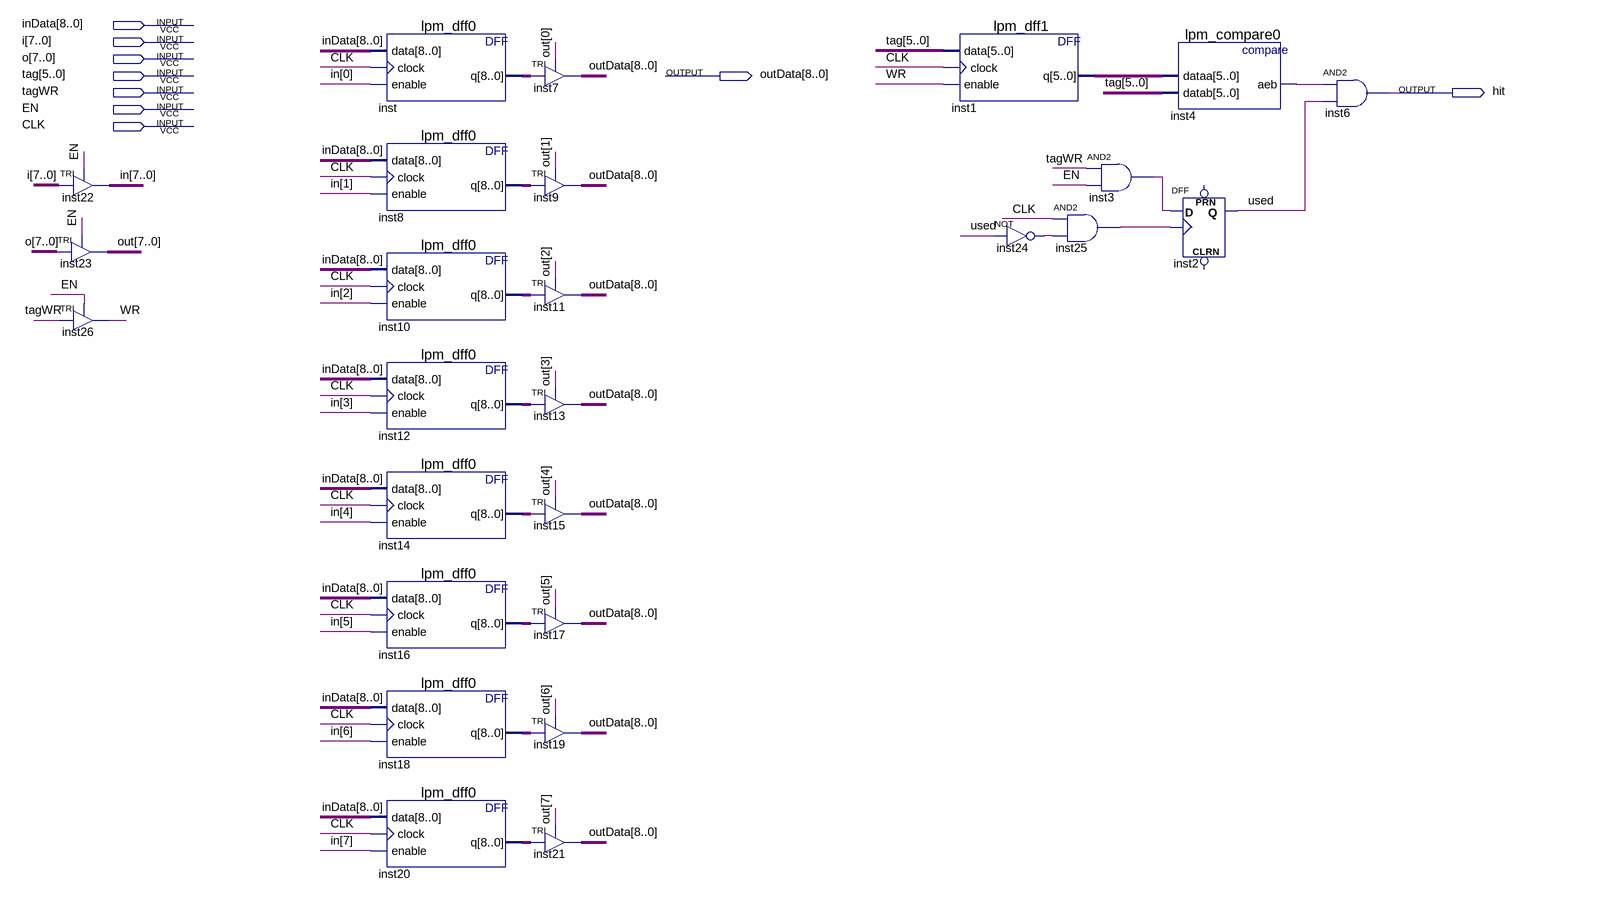
[diagram p0: schematic sheet]
// Quartus schematic line.bdf as structural Verilog: 26 symbols, 9 pins
module line (
  input  [8:0] inData,
  input  [7:0] i,
  input  [7:0] o,
  input  [5:0] tag,
  input  tagWR,
  input  EN,
  input  CLK,
  output [8:0] outData,
  output hit
);

  wire inst3_out, inst4_aeb, inst24_out, inst25_out, used, WR;
  wire [5:0] inst1_q;
  wire [7:0] in, out;
  wire [8:0] inst8_q, inst10_q, inst12_q, inst14_q, inst16_q, inst18_q, inst20_q, inst_q;

  TRI inst22[7:0] (.IN(i), .OE(EN), .OUT(in));
  TRI inst23[7:0] (.IN(o), .OE(EN), .OUT(out));
  TRI inst26 (.IN(tagWR), .OE(EN), .OUT(WR));
  lpm_dff0 inst (.data(inData), .clock(CLK), .enable(in[0]), .q(inst_q));
  lpm_dff0 inst8 (.data(inData), .clock(CLK), .enable(in[1]), .q(inst8_q));
  lpm_dff0 inst10 (.data(inData), .clock(CLK), .enable(in[2]), .q(inst10_q));
  lpm_dff0 inst12 (.data(inData), .clock(CLK), .enable(in[3]), .q(inst12_q));
  lpm_dff0 inst14 (.data(inData), .clock(CLK), .enable(in[4]), .q(inst14_q));
  lpm_dff0 inst16 (.data(inData), .clock(CLK), .enable(in[5]), .q(inst16_q));
  lpm_dff0 inst18 (.data(inData), .clock(CLK), .enable(in[6]), .q(inst18_q));
  lpm_dff0 inst20 (.data(inData), .clock(CLK), .enable(in[7]), .q(inst20_q));
  TRI inst7[8:0] (.IN(inst_q), .OE(out[0]), .OUT(outData));
  TRI inst9[8:0] (.IN(inst8_q), .OE(out[1]), .OUT(outData));
  TRI inst11[8:0] (.IN(inst10_q), .OE(out[2]), .OUT(outData));
  TRI inst13[8:0] (.IN(inst12_q), .OE(out[3]), .OUT(outData));
  TRI inst15[8:0] (.IN(inst14_q), .OE(out[4]), .OUT(outData));
  TRI inst17[8:0] (.IN(inst16_q), .OE(out[5]), .OUT(outData));
  TRI inst19[8:0] (.IN(inst18_q), .OE(out[6]), .OUT(outData));
  TRI inst21[8:0] (.IN(inst20_q), .OE(out[7]), .OUT(outData));
  lpm_dff1 inst1 (.data(tag), .clock(CLK), .enable(WR), .q(inst1_q));
  not inst24 (inst24_out, used);
  and inst25 (inst25_out, CLK, inst24_out);
  and inst3 (inst3_out, tagWR, EN);
  lpm_compare0 inst4 (.dataa(inst1_q), .datab(tag), .aeb(inst4_aeb));
  DFF inst2 (.CLK(inst25_out), .D(inst3_out), .Q(used));  // open: CLRN, PRN
  and inst6 (hit, inst4_aeb, used);
endmodule
